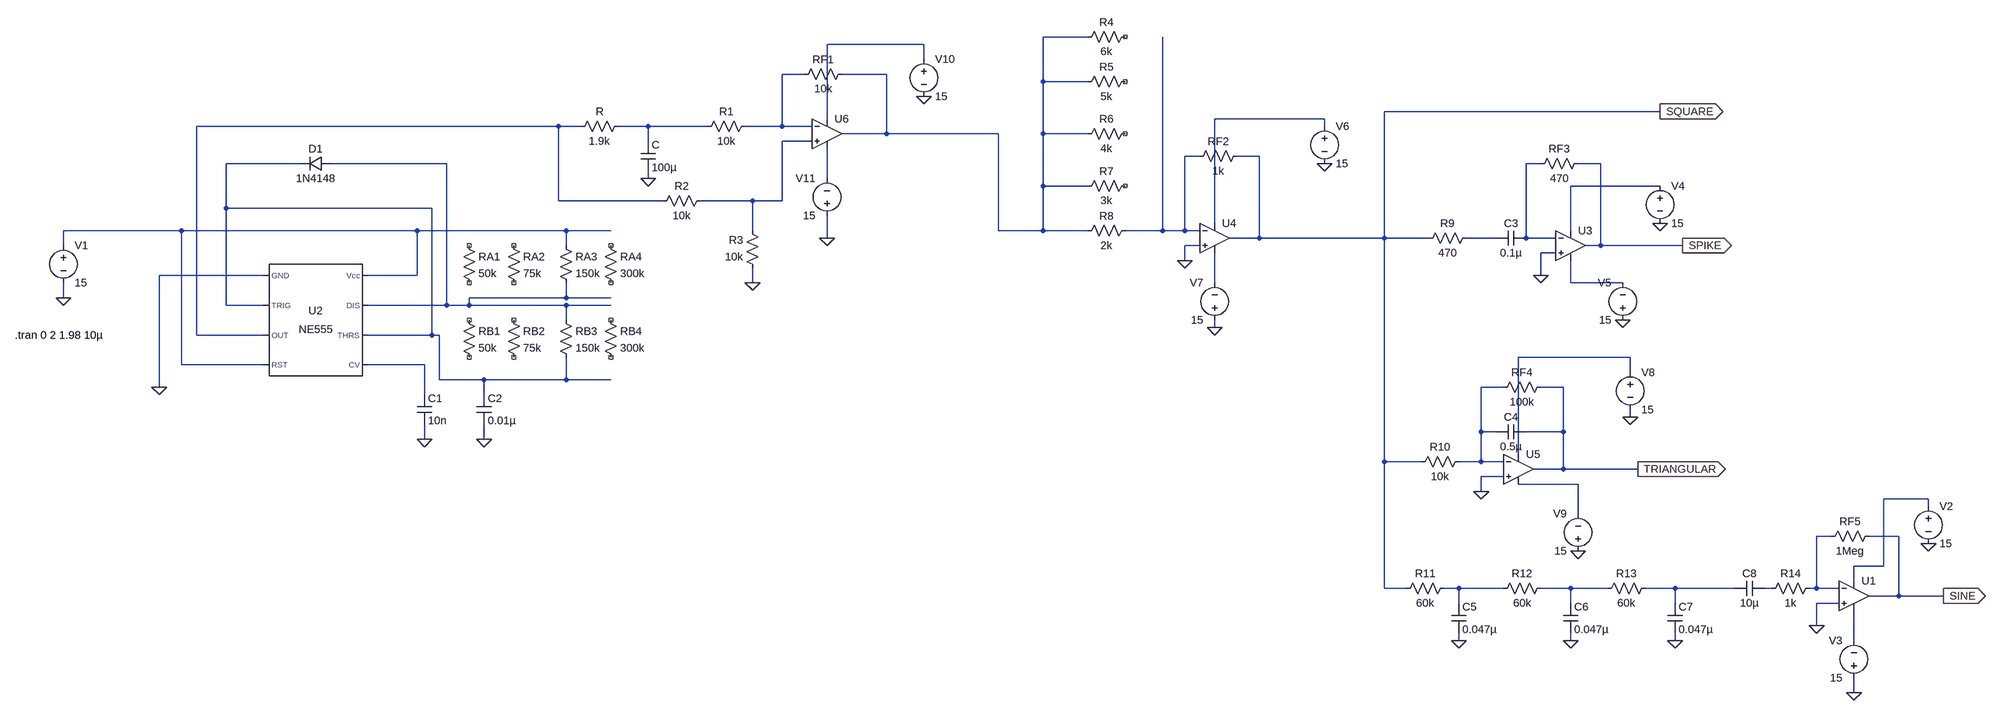
[diagram p0: schematic function_generator.asc]
function_generator.asc, the LTspice schematic file:
Version 4
SHEET 1 2852 1492
WIRE 880 -448 784 -448
WIRE 528 -432 320 -432
WIRE 528 -400 528 -432
WIRE 272 -368 224 -368
WIRE 448 -368 352 -368
WIRE 784 -352 784 -448
WIRE 880 -352 784 -352
WIRE 2128 -288 1536 -288
WIRE 320 -272 320 -432
WIRE 1408 -272 1152 -272
WIRE -256 -256 -1040 -256
WIRE -208 -256 -256 -256
WIRE -64 -256 -128 -256
WIRE 64 -256 -64 -256
WIRE 224 -256 224 -368
WIRE 224 -256 144 -256
WIRE 288 -256 224 -256
WIRE 1408 -256 1408 -272
WIRE 448 -240 448 -368
WIRE 448 -240 352 -240
WIRE 688 -240 448 -240
WIRE 784 -240 784 -352
WIRE 880 -240 784 -240
WIRE -64 -224 -64 -256
WIRE 288 -224 224 -224
WIRE 1120 -192 1088 -192
WIRE 1248 -192 1200 -192
WIRE -816 -176 -976 -176
WIRE -496 -176 -752 -176
WIRE 1872 -176 1840 -176
WIRE 2000 -176 1952 -176
WIRE -64 -144 -64 -160
WIRE 320 -144 320 -208
WIRE 784 -128 784 -240
WIRE 880 -128 784 -128
WIRE 2128 -128 1936 -128
WIRE -256 -96 -256 -256
WIRE -32 -96 -256 -96
WIRE 160 -96 48 -96
WIRE 224 -96 224 -224
WIRE 224 -96 160 -96
WIRE -976 -80 -976 -176
WIRE -528 -80 -976 -80
WIRE 1152 -48 1152 -272
WIRE -1072 -32 -1344 -32
WIRE -560 -32 -1072 -32
WIRE -240 -32 -560 -32
WIRE -144 -32 -240 -32
WIRE 160 -32 160 -96
WIRE 688 -32 688 -240
WIRE 784 -32 784 -128
WIRE 784 -32 688 -32
WIRE 880 -32 784 -32
WIRE 1040 -32 1040 -448
WIRE 1040 -32 960 -32
WIRE 1088 -32 1088 -192
WIRE 1088 -32 1040 -32
WIRE 1120 -32 1088 -32
WIRE 1936 -32 1936 -128
WIRE 320 -16 320 -64
WIRE 1248 -16 1248 -192
WIRE 1248 -16 1184 -16
WIRE 1536 -16 1536 -288
WIRE 1536 -16 1248 -16
WIRE 1632 -16 1536 -16
WIRE 1776 -16 1712 -16
WIRE 1840 -16 1840 -176
WIRE 1904 -16 1840 -16
WIRE -1344 0 -1344 -32
WIRE -240 0 -240 -32
WIRE 1120 0 1088 0
WIRE 2000 0 2000 -176
WIRE 2000 0 1968 0
WIRE 2176 0 2000 0
WIRE 1904 16 1872 16
WIRE 1088 32 1088 0
WIRE -896 64 -1120 64
WIRE -560 64 -560 -32
WIRE -560 64 -672 64
WIRE 1872 64 1872 16
WIRE 160 80 160 48
WIRE 1152 80 1152 16
WIRE 1936 80 1936 32
WIRE 2048 80 1936 80
WIRE -1344 112 -1344 80
WIRE -240 112 -240 80
WIRE -240 112 -448 112
WIRE -144 112 -240 112
WIRE -976 128 -976 -80
WIRE -896 128 -976 128
WIRE -496 128 -496 -176
WIRE -496 128 -672 128
WIRE -448 128 -448 112
WIRE -448 128 -496 128
WIRE -240 128 -448 128
WIRE -144 128 -240 128
WIRE -240 160 -240 128
WIRE 1152 176 1152 160
WIRE -1040 192 -1040 -256
WIRE -896 192 -1040 192
WIRE -528 192 -528 -80
WIRE -528 192 -672 192
WIRE -512 192 -528 192
WIRE 2064 240 1824 240
WIRE -1072 256 -1072 -32
WIRE -896 256 -1072 256
WIRE -544 256 -672 256
WIRE 2064 272 2064 240
WIRE -512 288 -512 192
WIRE -416 288 -512 288
WIRE -240 288 -240 240
WIRE -240 288 -416 288
WIRE -144 288 -240 288
WIRE -1120 304 -1120 64
WIRE 1792 304 1744 304
WIRE 1920 304 1872 304
WIRE -544 320 -544 256
WIRE -416 320 -416 288
WIRE 2064 368 2064 352
WIRE 1744 400 1744 304
WIRE 1776 400 1744 400
WIRE 1920 400 1920 304
WIRE 1920 400 1840 400
WIRE -544 416 -544 384
WIRE -416 416 -416 384
WIRE 1824 448 1824 240
WIRE 1536 464 1536 -16
WIRE 1616 464 1536 464
WIRE 1744 464 1744 400
WIRE 1744 464 1696 464
WIRE 1792 464 1744 464
WIRE 1920 480 1920 400
WIRE 1920 480 1856 480
WIRE 2080 480 1920 480
WIRE 1792 496 1744 496
WIRE 1952 512 1824 512
WIRE 1744 528 1744 496
WIRE 2704 544 2608 544
WIRE 2704 560 2704 544
WIRE 1952 576 1952 512
WIRE 2496 624 2464 624
WIRE 2640 624 2576 624
WIRE 2608 688 2608 544
WIRE 2608 688 2544 688
WIRE 2544 720 2544 688
WIRE 1536 736 1536 464
WIRE 1584 736 1536 736
WIRE 1696 736 1664 736
WIRE 1792 736 1696 736
WIRE 1936 736 1872 736
WIRE 2016 736 1936 736
WIRE 2160 736 2096 736
WIRE 2288 736 2160 736
WIRE 2368 736 2352 736
WIRE 2464 736 2464 624
WIRE 2464 736 2448 736
WIRE 2512 736 2464 736
WIRE 2640 752 2640 624
WIRE 2640 752 2576 752
WIRE 2736 752 2640 752
WIRE 1696 768 1696 736
WIRE 1936 768 1936 736
WIRE 2160 768 2160 736
WIRE 2512 768 2464 768
WIRE 2464 816 2464 768
WIRE 1696 848 1696 832
WIRE 1936 848 1936 832
WIRE 2160 848 2160 832
WIRE 2544 848 2544 784
WIRE 2544 960 2544 928
FLAG -1120 304 0
FLAG -544 416 0
FLAG -416 416 0
FLAG 2048 160 0
FLAG 2128 -48 0
FLAG 1872 64 0
FLAG 2176 0 SPIKE
IOPIN 2176 0 Out
FLAG 1408 -176 0
FLAG 1152 176 0
FLAG 1088 32 0
FLAG 1952 656 0
FLAG 2064 368 0
FLAG 1744 528 0
FLAG 2080 480 TRIANGULAR
IOPIN 2080 480 Out
FLAG -64 -144 0
FLAG 528 -320 0
FLAG 320 -16 0
FLAG 160 80 0
FLAG -1344 112 0
FLAG 1936 848 0
FLAG 2736 752 SINE
IOPIN 2736 752 Out
FLAG 1696 848 0
FLAG 2160 848 0
FLAG 2464 816 0
FLAG 2704 640 0
FLAG 2544 960 0
FLAG 2128 -288 SQUARE
IOPIN 2128 -288 Out
SYMBOL NE555 -784 160 R0
SYMATTR InstName U2
SYMBOL res -368 -16 R0
SYMATTR InstName RA2
SYMATTR Value 75k
SYMBOL res -368 144 R0
SYMATTR InstName RB2
SYMATTR Value 75k
SYMBOL cap -560 320 R0
SYMATTR InstName C1
SYMATTR Value 10n
SYMBOL cap -432 320 R0
SYMATTR InstName C2
SYMATTR Value 0.01µ
SYMBOL diode -752 -192 R90
WINDOW 0 0 32 VBottom 2
WINDOW 3 32 32 VTop 2
SYMATTR InstName D1
SYMATTR Value 1N4148
SYMBOL cap 1840 -32 R90
WINDOW 0 0 32 VBottom 2
WINDOW 3 32 32 VTop 2
SYMATTR InstName C3
SYMATTR Value 0.1µ
SYMBOL res 1728 -32 R90
WINDOW 0 0 56 VBottom 2
WINDOW 3 32 56 VTop 2
SYMATTR InstName R9
SYMATTR Value 470
SYMBOL voltage 2128 -144 R0
WINDOW 123 0 0 Left 0
WINDOW 39 0 0 Left 0
SYMATTR InstName V4
SYMATTR Value 15
SYMBOL voltage 2048 176 R180
WINDOW 0 24 96 Left 2
WINDOW 3 24 16 Left 2
WINDOW 123 0 0 Left 0
WINDOW 39 0 0 Left 0
SYMATTR InstName V5
SYMATTR Value 15
SYMBOL res 1968 -192 R90
WINDOW 0 0 56 VBottom 2
WINDOW 3 32 56 VTop 2
SYMATTR InstName RF3
SYMATTR Value 470
SYMBOL OpAmps\\UniversalOpamp2 1936 0 R0
SYMATTR InstName U3
SYMBOL OpAmps\\UniversalOpamp2 1152 -16 R0
SYMATTR InstName U4
SYMBOL voltage 1408 -272 R0
WINDOW 123 0 0 Left 0
WINDOW 39 0 0 Left 0
SYMATTR InstName V6
SYMATTR Value 15
SYMBOL voltage 1152 176 R180
WINDOW 0 24 96 Left 2
WINDOW 3 24 16 Left 2
WINDOW 123 0 0 Left 0
WINDOW 39 0 0 Left 0
SYMATTR InstName V7
SYMATTR Value 15
SYMBOL res 976 -48 R90
WINDOW 0 0 56 VBottom 2
WINDOW 3 32 56 VTop 2
SYMATTR InstName R8
SYMATTR Value 2k
SYMBOL res 976 -144 R90
WINDOW 0 0 56 VBottom 2
WINDOW 3 32 56 VTop 2
SYMATTR InstName R7
SYMATTR Value 3k
SYMBOL res 976 -256 R90
WINDOW 0 0 56 VBottom 2
WINDOW 3 32 56 VTop 2
SYMATTR InstName R6
SYMATTR Value 4k
SYMBOL res 976 -368 R90
WINDOW 0 0 56 VBottom 2
WINDOW 3 32 56 VTop 2
SYMATTR InstName R5
SYMATTR Value 5k
SYMBOL res 976 -464 R90
WINDOW 0 0 56 VBottom 2
WINDOW 3 32 56 VTop 2
SYMATTR InstName R4
SYMATTR Value 6k
SYMBOL res 1216 -208 R90
WINDOW 0 0 56 VBottom 2
WINDOW 3 32 56 VTop 2
SYMATTR InstName RF2
SYMATTR Value 1k
SYMBOL cap 1840 384 R90
WINDOW 0 0 32 VBottom 2
WINDOW 3 32 32 VTop 2
SYMATTR InstName C4
SYMATTR Value 0.5µ
SYMBOL res 1712 448 R90
WINDOW 0 0 56 VBottom 2
WINDOW 3 32 56 VTop 2
SYMATTR InstName R10
SYMATTR Value 10k
SYMBOL voltage 2064 256 R0
WINDOW 123 0 0 Left 0
WINDOW 39 0 0 Left 0
SYMATTR InstName V8
SYMATTR Value 15
SYMBOL voltage 1952 672 R180
WINDOW 0 24 96 Left 2
WINDOW 3 24 16 Left 2
WINDOW 123 0 0 Left 0
WINDOW 39 0 0 Left 0
SYMATTR InstName V9
SYMATTR Value 15
SYMBOL OpAmps\\UniversalOpamp2 1824 480 R0
SYMATTR InstName U5
SYMBOL OpAmps\\UniversalOpamp2 320 -240 R0
SYMATTR InstName U6
SYMBOL res -112 -272 R90
WINDOW 0 0 56 VBottom 2
WINDOW 3 32 56 VTop 2
SYMATTR InstName R
SYMATTR Value 1.9k
SYMBOL cap -80 -224 R0
SYMATTR InstName C
SYMATTR Value 100µ
SYMBOL voltage 528 -416 R0
WINDOW 123 0 0 Left 0
WINDOW 39 0 0 Left 0
SYMATTR InstName V10
SYMATTR Value 15
SYMBOL voltage 320 -48 R180
WINDOW 0 24 96 Left 2
WINDOW 3 24 16 Left 2
WINDOW 123 0 0 Left 0
WINDOW 39 0 0 Left 0
SYMATTR InstName V11
SYMATTR Value 15
SYMBOL res 64 -112 R90
WINDOW 0 0 56 VBottom 2
WINDOW 3 32 56 VTop 2
SYMATTR InstName R2
SYMATTR Value 10k
SYMBOL res 176 64 R180
WINDOW 0 36 76 Left 2
WINDOW 3 36 40 Left 2
SYMATTR InstName R3
SYMATTR Value 10k
SYMBOL res 368 -384 R90
WINDOW 0 0 56 VBottom 2
WINDOW 3 32 56 VTop 2
SYMATTR InstName RF1
SYMATTR Value 10k
SYMBOL res 160 -272 R90
WINDOW 0 0 56 VBottom 2
WINDOW 3 32 56 VTop 2
SYMATTR InstName R1
SYMATTR Value 10k
SYMBOL res 1888 288 R90
WINDOW 0 0 56 VBottom 2
WINDOW 3 32 56 VTop 2
SYMATTR InstName RF4
SYMATTR Value 100k
SYMBOL res -256 -16 R0
SYMATTR InstName RA3
SYMATTR Value 150k
SYMBOL res -160 -16 R0
SYMATTR InstName RA4
SYMATTR Value 300k
SYMBOL res -256 144 R0
SYMATTR InstName RB3
SYMATTR Value 150k
SYMBOL res -160 144 R0
SYMATTR InstName RB4
SYMATTR Value 300k
SYMBOL res -464 -16 R0
SYMATTR InstName RA1
SYMATTR Value 50k
SYMBOL res -464 144 R0
SYMATTR InstName RB1
SYMATTR Value 50k
SYMBOL voltage -1344 -16 R0
WINDOW 123 0 0 Left 0
WINDOW 39 0 0 Left 0
SYMATTR InstName V1
SYMATTR Value 15
SYMBOL res 1888 720 R90
WINDOW 0 0 56 VBottom 2
WINDOW 3 32 56 VTop 2
SYMATTR InstName R12
SYMATTR Value 60k
SYMBOL cap 1680 768 R0
SYMATTR InstName C5
SYMATTR Value 0.047µ
SYMBOL cap 1920 768 R0
SYMATTR InstName C6
SYMATTR Value 0.047µ
SYMBOL res 1680 720 R90
WINDOW 0 0 56 VBottom 2
WINDOW 3 32 56 VTop 2
SYMATTR InstName R11
SYMATTR Value 60k
SYMBOL res 2112 720 R90
WINDOW 0 0 56 VBottom 2
WINDOW 3 32 56 VTop 2
SYMATTR InstName R13
SYMATTR Value 60k
SYMBOL cap 2144 768 R0
SYMATTR InstName C7
SYMATTR Value 0.047µ
SYMBOL cap 2352 720 R90
WINDOW 0 0 32 VBottom 2
WINDOW 3 32 32 VTop 2
SYMATTR InstName C8
SYMATTR Value 10µ
SYMBOL OpAmps\\UniversalOpamp2 2544 752 R0
SYMATTR InstName U1
SYMBOL res 2592 608 R90
WINDOW 0 0 56 VBottom 2
WINDOW 3 32 56 VTop 2
SYMATTR InstName RF5
SYMATTR Value 1Meg
SYMBOL res 2464 720 R90
WINDOW 0 0 56 VBottom 2
WINDOW 3 32 56 VTop 2
SYMATTR InstName R14
SYMATTR Value 1k
SYMBOL voltage 2704 544 R0
WINDOW 123 0 0 Left 0
WINDOW 39 0 0 Left 0
SYMATTR InstName V2
SYMATTR Value 15
SYMBOL voltage 2544 944 R180
WINDOW 0 24 96 Left 2
WINDOW 3 24 16 Left 2
WINDOW 123 0 0 Left 0
WINDOW 39 0 0 Left 0
SYMATTR InstName V3
SYMATTR Value 15
TEXT -1448 192 Left 2 !.tran 0 2 1.98 10µ

The netlist it stands for:
* function_generator.asc
XU2 0 N009 N005 N014 N019 N009 N010 N014 NE555  ; pins GND TRIG OUT RST CV THRS DIS Vcc
RA2 NC_01 NC_02 75k
RB2 NC_03 NC_04 75k
C1 N019 0 10n
C2 N009 0 0.01µ
D1 N010 N009 1N4148
C3 N011 N015 0.1µ
R9 N015 SQUARE 470
V4 N013 0 15
V5 0 N017 15
RF3 SPIKE N011 470
XU3 0 N011 N013 N017 SPIKE level.2 Avol=1Meg GBW=10Meg Slew=10Meg ilimit=25m rail=0 Vos=0 phimargin=45 en=0 enk=0 in=0 ink=0 Rin=500Meg  ; pins IN+ IN- V+ V- OUT
XU4 0 N008 N004 N016 SQUARE level.2 Avol=1Meg GBW=10Meg Slew=10Meg ilimit=25m rail=0 Vos=0 phimargin=45 en=0 enk=0 in=0 ink=0 Rin=500Meg  ; pins IN+ IN- V+ V- OUT
V6 N004 0 15
V7 0 N016 15
R8 N008 N001 2k
R7 NC_05 N001 3k
R6 NC_06 N001 4k
R5 NC_07 N001 5k
R4 NC_08 N001 6k
RF2 SQUARE N008 1k
C4 TRIANGULAR N020 0.5µ
R10 N020 SQUARE 10k
V8 N018 0 15
V9 0 N021 15
XU5 0 N020 N018 N021 TRIANGULAR level.2 Avol=1Meg GBW=10Meg Slew=10Meg ilimit=25m rail=0 Vos=0 phimargin=45 en=0 enk=0 in=0 ink=0 Rin=500Meg  ; pins IN+ IN- V+ V- OUT
XU6 N007 N003 N002 N012 N001 level.2 Avol=1Meg GBW=10Meg Slew=10Meg ilimit=25m rail=0 Vos=0 phimargin=45 en=0 enk=0 in=0 ink=0 Rin=500Meg  ; pins IN+ IN- V+ V- OUT
R N006 N005 1.9k
C N006 0 100µ
V10 N002 0 15
V11 0 N012 15
R2 N007 N005 10k
R3 0 N007 10k
RF1 N001 N003 10k
R1 N003 N006 10k
RF4 TRIANGULAR N020 100k
RA3 N014 N010 150k
RA4 NC_09 NC_10 300k
RB3 N010 N009 150k
RB4 NC_11 NC_12 300k
RA1 NC_13 NC_14 50k
RB1 NC_15 NC_16 50k
V1 N014 0 15
R12 N025 N024 60k
C5 N024 0 0.047µ
C6 N025 0 0.047µ
R11 N024 SQUARE 60k
R13 N026 N025 60k
C7 N026 0 0.047µ
C8 N027 N026 10µ
XU1 0 N023 N022 N028 SINE level.2 Avol=1Meg GBW=10Meg Slew=10Meg ilimit=25m rail=0 Vos=0 phimargin=45 en=0 enk=0 in=0 ink=0 Rin=500Meg  ; pins IN+ IN- V+ V- OUT
RF5 SINE N023 1Meg
R14 N023 N027 1k
V2 N022 0 15
V3 0 N028 15
.model D D
.lib standard.dio
.tran 0 2 1.98 10µ
.lib NE555.sub
.lib UniversalOpamps2.sub
.backanno
.end